# EAGLE schematic tubizzerr (EAGLE 7.6.0)
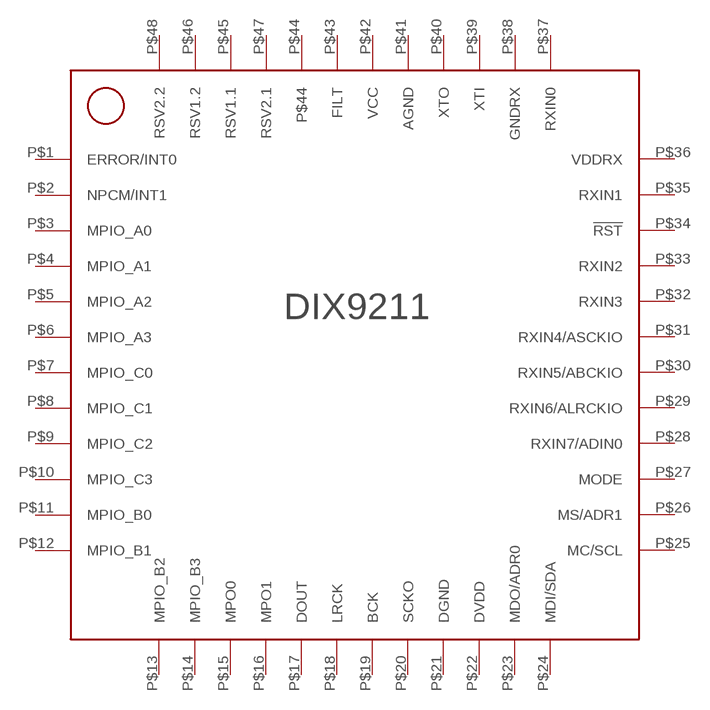
[diagram p0: schematic, sheet 1]

## Parts
U$1  DIX9211PT  [STM_LQFP48]
Unconnected: U$1.P$1(ERROR/INT0) U$1.P$2(NPCM/INT1) U$1.P$3(MPIO_A0) U$1.P$4(MPIO_A1) U$1.P$5(MPIO_A2) U$1.P$6(MPIO_A3) U$1.P$7(MPIO_C0) U$1.P$8(MPIO_C1) U$1.P$9(MPIO_C2) U$1.P$10(MPIO_C3) U$1.P$11(MPIO_B0) U$1.P$12(MPIO_B1) U$1.P$13(MPIO_B2) U$1.P$14(MPIO_B3) U$1.P$15(MPO0) U$1.P$16(MPO1) U$1.P$17(DOUT) U$1.P$18(LRCK) U$1.P$19(BCK) U$1.P$20(SCKO) U$1.P$21(DGND) U$1.P$22(DVDD) U$1.P$23(MDO/ADR0) U$1.P$24(MDI/SDA) U$1.P$25(MC/SCL) U$1.P$26(MS/ADR1) U$1.P$27(MODE) U$1.P$28(RXIN7/ADIN0) U$1.P$29(RXIN6/ALRCKIO) U$1.P$30(RXIN5/ABCKIO) U$1.P$31(RXIN4/ASCKIO) U$1.P$32(RXIN3) U$1.P$33(RXIN2) U$1.P$34(!RST!) U$1.P$35(RXIN1) U$1.P$36(VDDRX) U$1.P$37(RXIN0) U$1.P$38(GNDRX) U$1.P$39(XTI) U$1.P$40(XTO) U$1.P$41(AGND) U$1.P$42(VCC) U$1.P$43(FILT) U$1.P$44 U$1.P$45(RSV1.1) U$1.P$46(RSV1.2) U$1.P$47(RSV2.1) U$1.P$48(RSV2.2)

## Library data of the parts
U$1 = dix9211:DIX9211